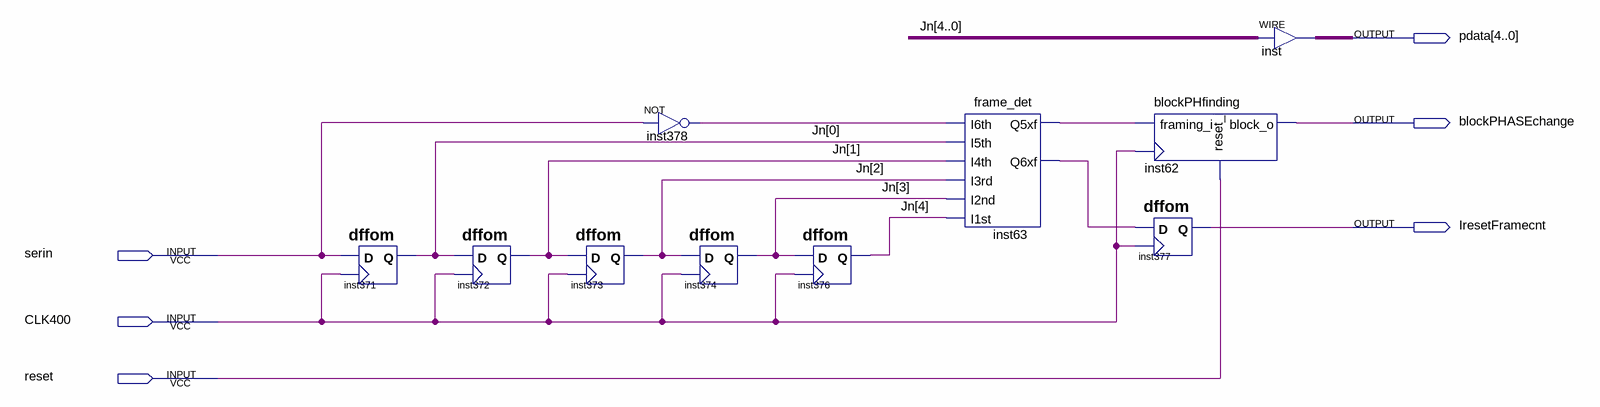
[diagram p0: schematic sheet]
// Quartus schematic frame_detector.bdf as structural Verilog: 10 symbols, 6 pins
module frame_detector (
  input  serin,
  input  CLK400,
  input  reset,
  output [4:0] pdata,
  output blockPHASEchange,
  output IresetFramecnt
);

  wire inst63_q5xf, inst63_q6xf, inst378_out;
  wire [4:0] Jn;

  dffom inst371 (.D(serin), .CK(CLK400), .Q(Jn[0]));
  dffom inst372 (.D(Jn[0]), .CK(CLK400), .Q(Jn[1]));
  dffom inst373 (.D(Jn[1]), .CK(CLK400), .Q(Jn[2]));
  not inst378 (inst378_out, serin);
  dffom inst374 (.D(Jn[2]), .CK(CLK400), .Q(Jn[3]));
  dffom inst376 (.D(Jn[3]), .CK(CLK400), .Q(Jn[4]));
  frame_det inst63 (
    .I1st(Jn[4]), .I2nd(Jn[3]), .I3rd(Jn[2]), .I4th(Jn[1]), .I5th(Jn[0]), .I6th(inst378_out),
    .Q5xf(inst63_q5xf), .Q6xf(inst63_q6xf));
  blockPHfinding inst62 (.reset_i(reset), .framing_i(inst63_q5xf), .clk_i(CLK400), .block_o(blockPHASEchange));
  dffom inst377 (.D(inst63_q6xf), .CK(CLK400), .Q(IresetFramecnt));
  assign pdata = Jn;  // WIRE inst
endmodule
